# EAGLE design v0-cellphone (EAGLE 6.4)
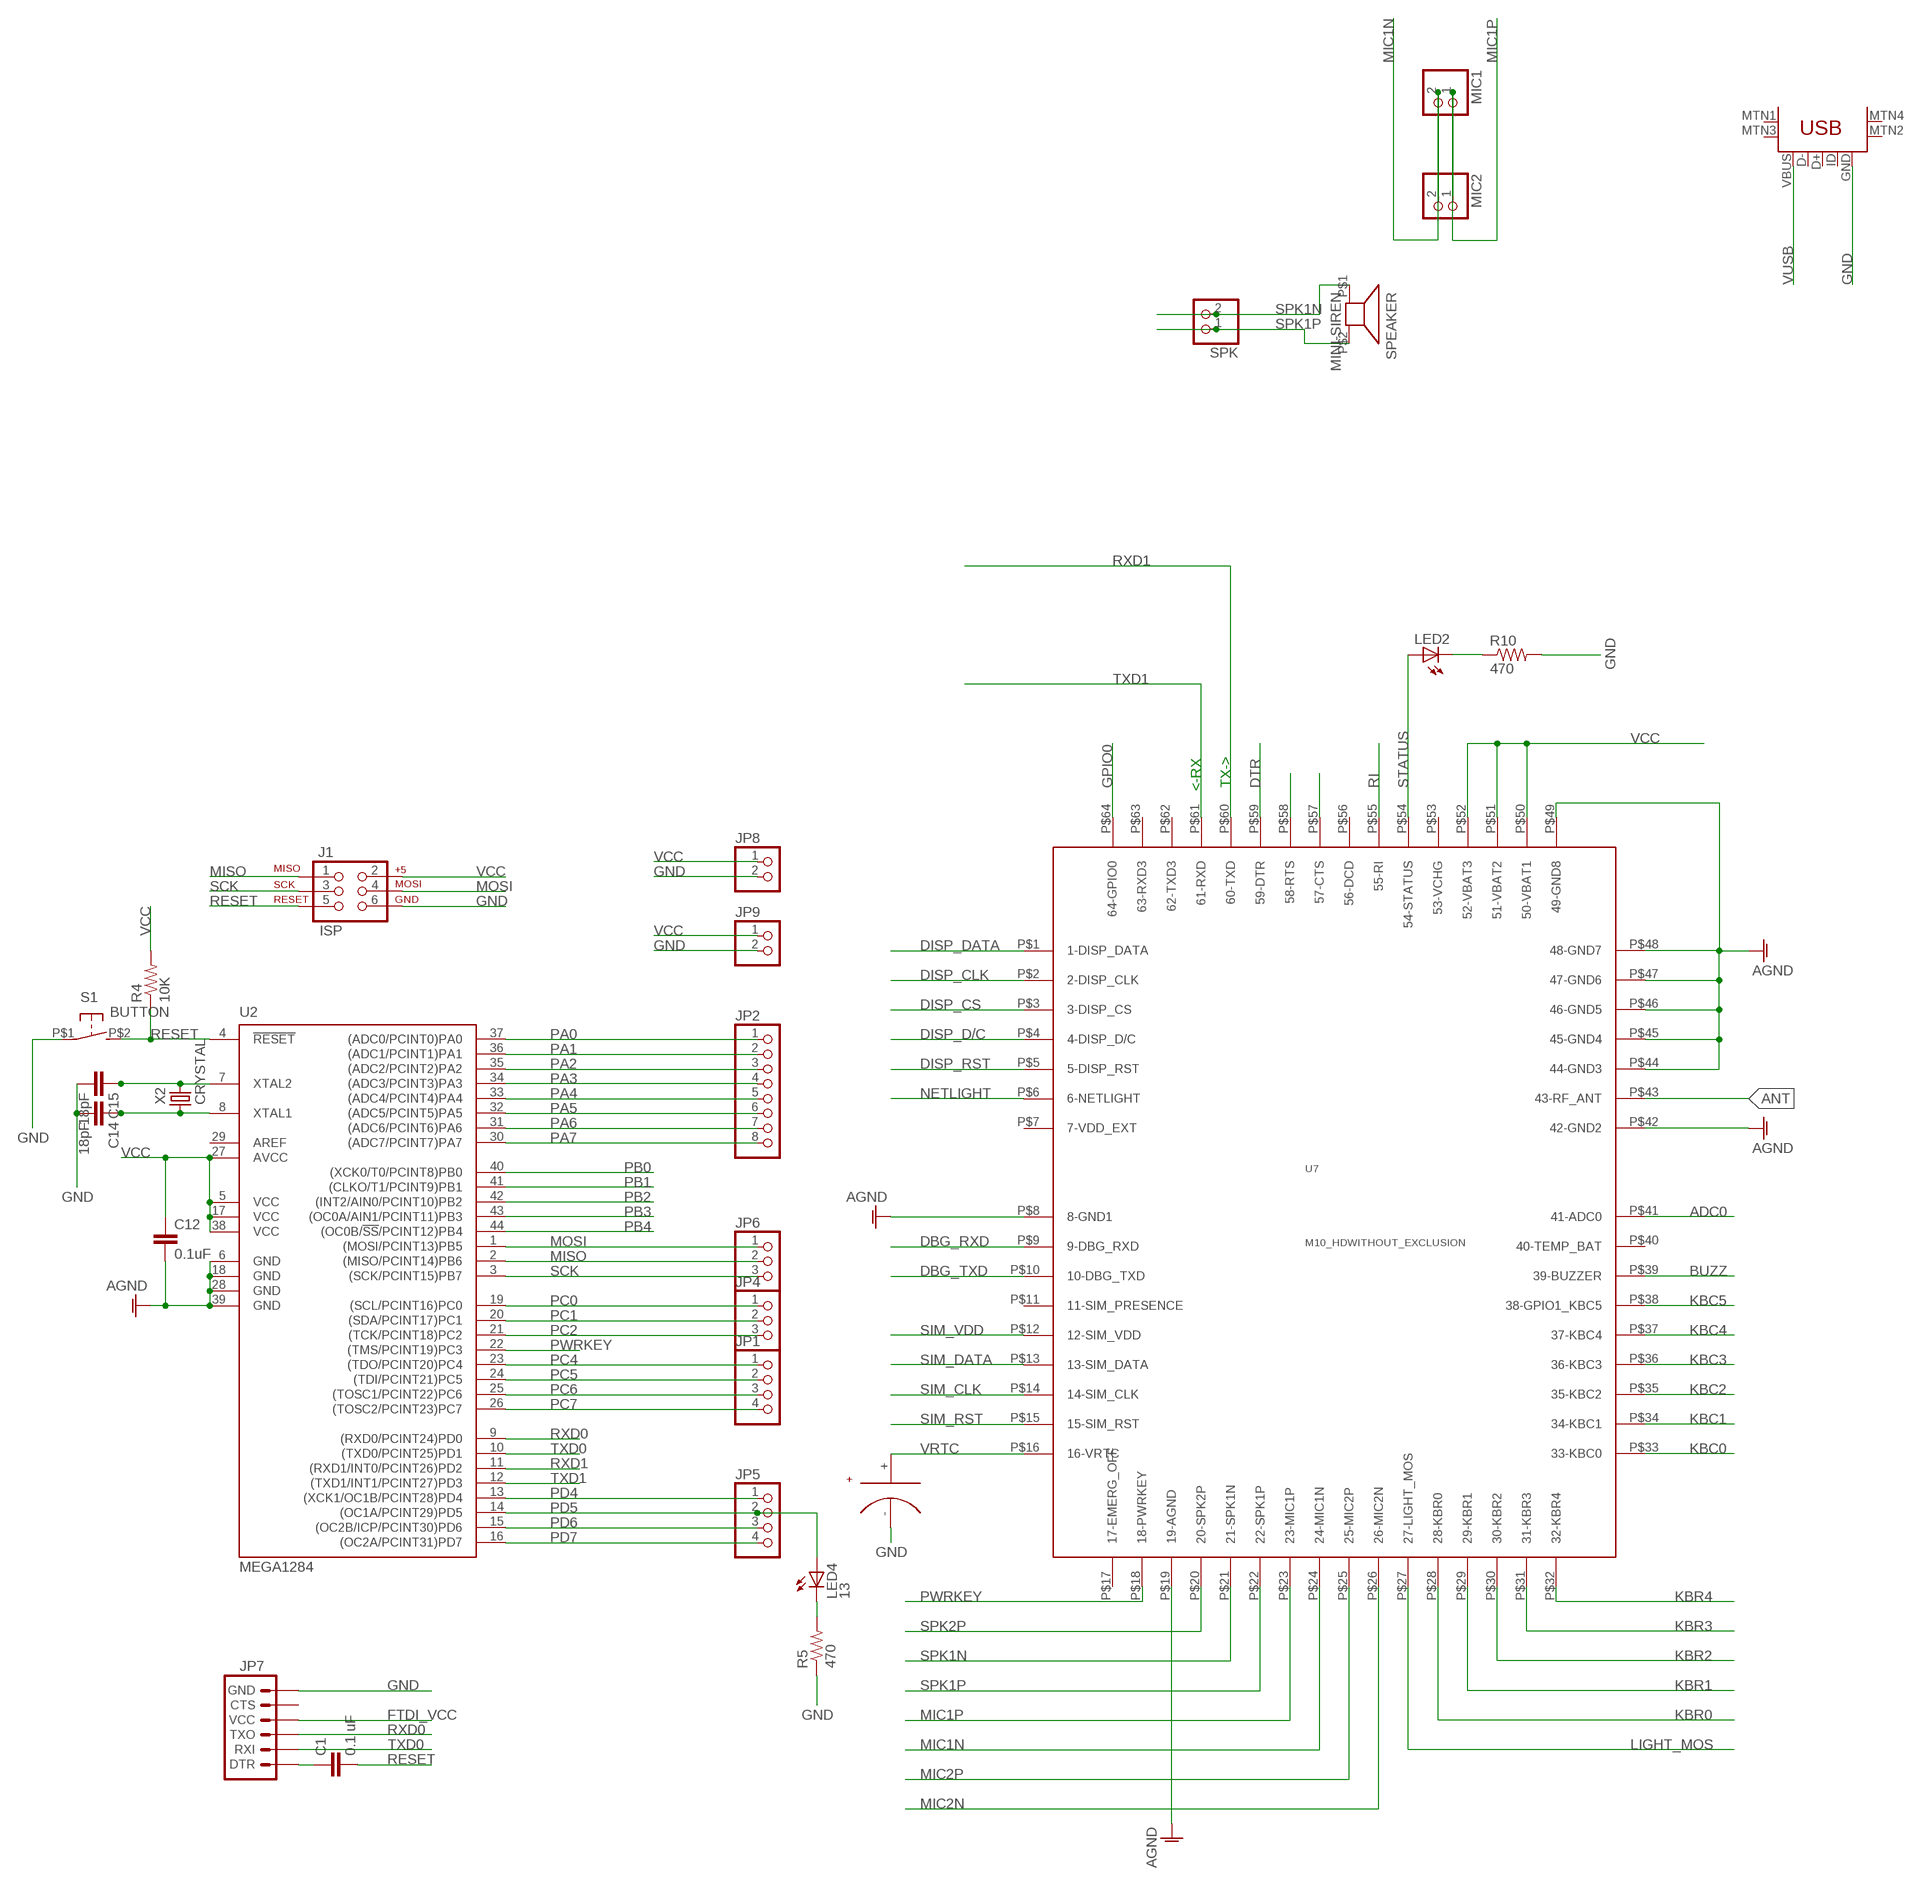
[diagram p0: schematic, sheet 1, part 1 of 2]
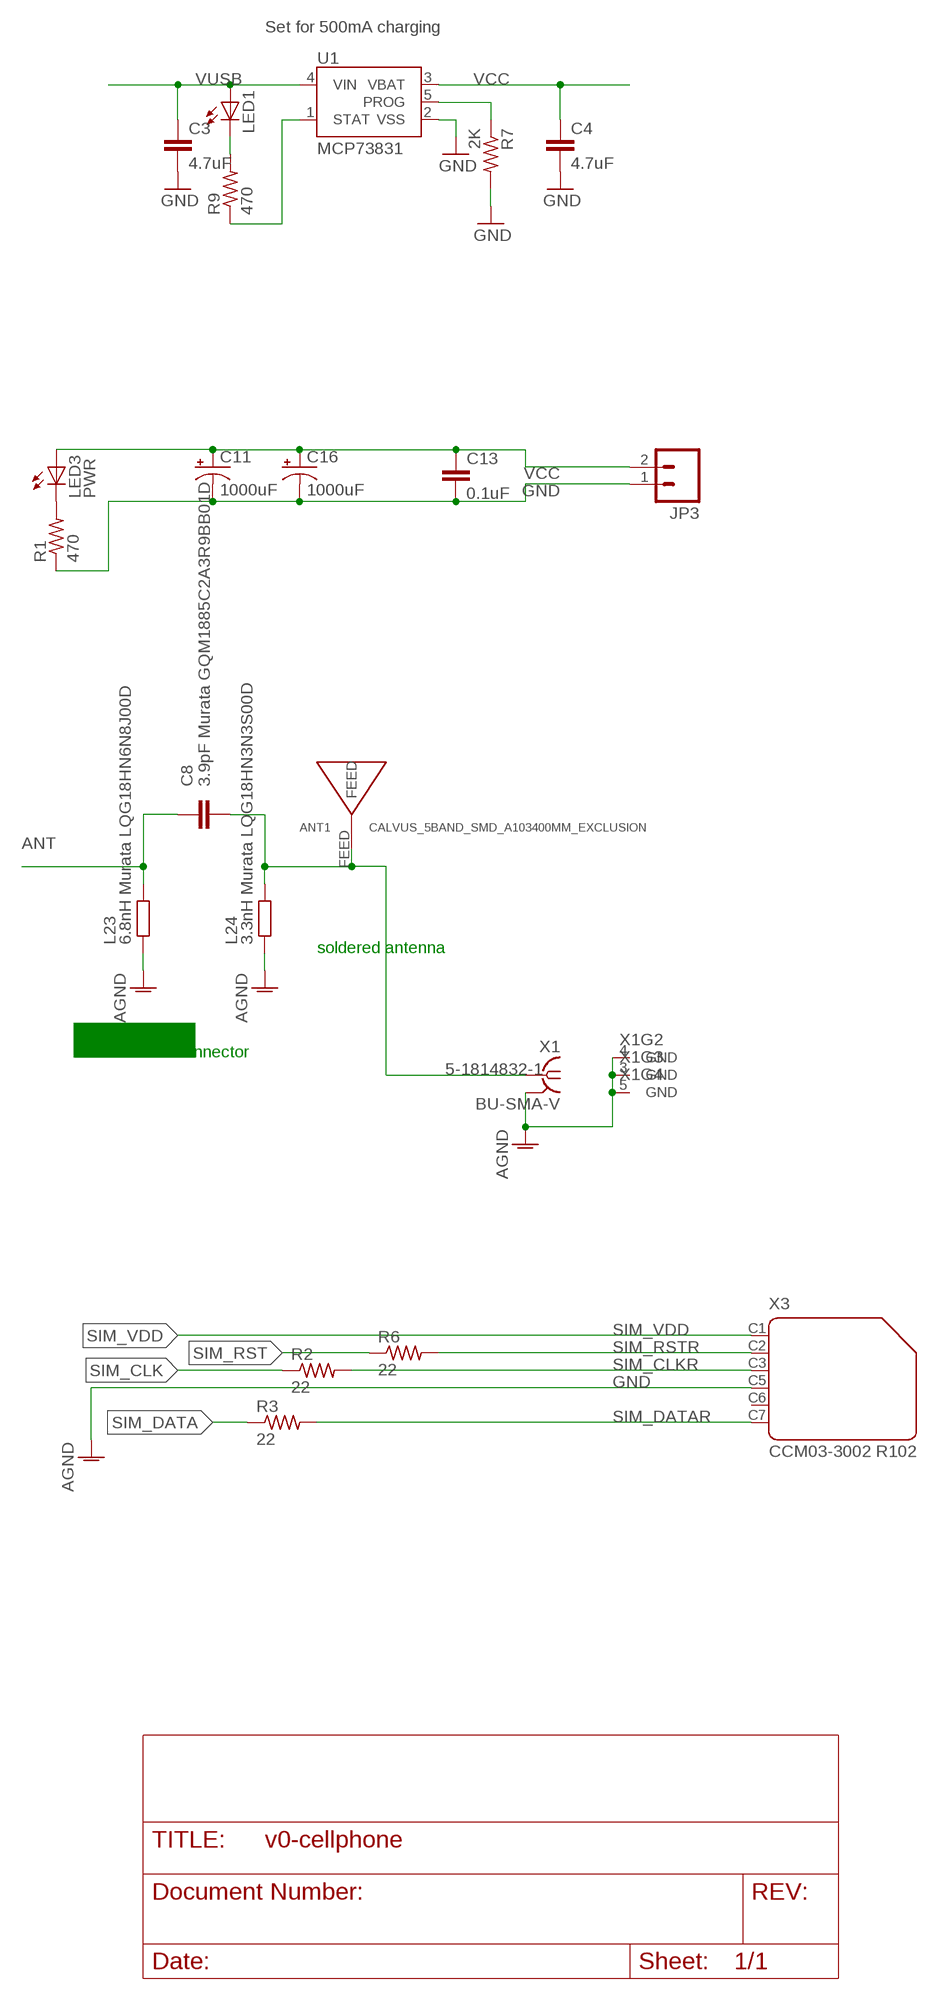
[diagram p1: schematic, sheet 1, part 2 of 2]

## Parts
ANT1  CALVUS_5BAND_SMD_A103400MM_EXCLUSION  [CALVUS_5BAND_SMD_A10340_0MM_EXCLUSION]
C1  0.1 uF  C-EUC1206  [C1206]
C2  SUPERCAPPAS  [414-VA5R]
C3  4.7uF  C-EUC1206  [C1206]
C4  4.7uF  C-EUC1206  [C1206]
C8  3.9pF Murata GQM1885C2A3R9BB01D  C-EU0603-RND  [C0603-ROUND]
C11  1000uF  CPOL-USD/7343-31R  [D/7343-31R]
C12  0.1uF  C-EUC1206  [C1206]
C13  0.1uF  C-EUC1206  [C1206]
C14  18pF  C-EUC1206  [C1206]
C15  18pF  C-EUC1206  [C1206]
C16  1000uF  CPOL-USD/7343-31R  [D/7343-31R]
J1  ISP  AVR_SPI_PRG_6NS  [2X3-NS]
J2  USB-MINIB-5PIN  [USB-MINIB]
JP1  PINHD-1X4  [1X04]
JP2  PINHD-1X8  [1X08]
JP3  M02-JST-2MM-SMT  [JST-2-SMD]
JP4  PINHD-1X3  [1X03]
JP5  PINHD-1X4  [1X04]
JP6  PINHD-1X3  [1X03]
JP7  ARDUINO_SERIAL_PROGRAMSMD-NOHOLES  [1X06-SMD-NOHOLES]
JP8  PINHD-1X2  [1X02]
JP9  PINHD-1X2  [1X02]
L23  6.8nH Murata LQG18HN6N8J00D  R-EU_0603-RND  [R0603-ROUND]
L24  3.3nH Murata LQG18HN3N3S00D  R-EU_0603-RND  [R0603-ROUND]
LED1  LEDSMT1206  [1206]
LED2  LEDSMT1206  [1206]
LED3  PWR  LEDSMT1206  [1206]
LED4  13  LEDSMT1206  [1206]
MIC1  PINHD-1X2  [1X02]
MIC2  PINHD-1X2  [1X02]
R1  470  R-US_R1206  [R1206]
R2  22  R-US_R1206  [R1206]
R3  22  R-US_R1206  [R1206]
R4  10K  R-US_R1206  [R1206]
R5  470  R-US_R1206  [R1206]
R6  22  R-US_R1206  [R1206]
R7  2K  R-US_R1206  [R1206]
R9  470  R-US_R1206  [R1206]
R10  470  R-US_R1206  [R1206]
S1  BUTTON  BUTTON-2  [B3U-1000P]
SPEAKER  MINI-SIREN  [SPEAKER-6.4MM]
SPK  PINHD-1X2  [1X02]
U1  MCP73831  [SOT23-5]
U2  MEGA1284  MEGA164P/324P/644P-AU  [TQFP44]
U7  M10_HDWITHOUT_EXCLUSION  [M10_HD_WITHOUT_EXCLUSION]
X1  BU-SMA-V  [BU-SMA-V]
X2  CRYSTAL  [2-SMD-5X3MM]
X3  CCM03-3002 R102  CON-AMPHENOL_SIMLOCK-C707_10M006_512_2  [CON-AMPHENOL_C707_10M006_512_2]

## Nets
ADC0: U7.P$41(41-ADC0)
ANT [antenna]: C8.1 L23.2 U7.P$43(43-RF_ANT)
ANTENA [antenna]: ANT1.FEED C8.2 L24.2 X1.1
BUZZ: U7.P$39(39-BUZZER)
DBG_RXD: U7.P$9(9-DBG_RXD)
DBG_TXD: U7.P$10(10-DBG_TXD)
DISP_CLK: U7.P$2(2-DISP_CLK)
DISP_CS: U7.P$3(3-DISP_CS)
DISP_D/C: U7.P$4(4-DISP_D/C)
DISP_DATA: U7.P$1(1-DISP_DATA)
DISP_RST: U7.P$5(5-DISP_RST)
DTR: U7.P$59(59-DTR)
FTDI_VCC: JP7.4(VCC)
GND [gnd]: C2.- C3.2 C4.2 C11.- C12.2 C13.2 C14.2 C15.2 C16.- J1.6 J2.GND JP3.1 JP7.6(GND) JP8.2 JP9.2 L23.1 L24.1 R1.1 R5.1 R7.2 R10.2 S1.P$1(P) U1.2(VSS) U2.6(GND) U2.18(GND) U2.28(GND) U2.39(GND) U7.P$8(8-GND1) U7.P$19(19-AGND) U7.P$42(42-GND2) U7.P$44(44-GND3) U7.P$45(45-GND4) U7.P$46(46-GND5) U7.P$47(47-GND6) U7.P$48(48-GND7) U7.P$49(49-GND8) X1.2(GND) X1.3(GND) X1.4(GND) X1.5(GND) X3.C5 ; supply symbol labelled AGND
GPIO0: U7.P$64(64-GPIO0)
KBC0: U7.P$33(33-KBC0)
KBC1: U7.P$34(34-KBC1)
KBC2: U7.P$35(35-KBC2)
KBC3: U7.P$36(36-KBC3)
KBC4: U7.P$37(37-KBC4)
KBC5: U7.P$38(38-GPIO1_KBC5)
KBR0: U7.P$28(28-KBR0)
KBR1: U7.P$29(29-KBR1)
KBR2: U7.P$30(30-KBR2)
KBR3: U7.P$31(31-KBR3)
KBR4: U7.P$32(32-KBR4)
LIGHT_MOS: U7.P$27(27-LIGHT_MOS)
MIC1N: MIC1.2 MIC2.2 U7.P$24(24-MIC1N)
MIC1P: MIC1.1 MIC2.1 U7.P$23(23-MIC1P)
MIC2N: U7.P$26(26-MIC2N)
MIC2P: U7.P$25(25-MIC2P)
MISO: J1.1 JP6.2 U2.2((MISO/PCINT14)PB6)
MOSI: J1.4 JP6.1 U2.1((MOSI/PCINT13)PB5)
N$1: U7.P$57(57-CTS)
N$2: LED3.C R1.2
N$3: LED4.C R5.2
N$5: C1.1 JP7.1(DTR)
N$7: C15.1 U2.7(XTAL2) X2.P$2
N$8: C14.1 U2.8(XTAL1) X2.P$1
N$35: R9.1 U1.1(STAT)
N$36: LED1.C R9.2
N$37: LED2.C R10.1
N$43: U7.P$58(58-RTS)
NETLIGHT: U7.P$6(6-NETLIGHT)
PA0: JP2.1 U2.37((ADC0/PCINT0)PA0)
PA1: JP2.2 U2.36((ADC1/PCINT1)PA1)
PA2: JP2.3 U2.35((ADC2/PCINT2)PA2)
PA3: JP2.4 U2.34((ADC3/PCINT3)PA3)
PA4: JP2.5 U2.33((ADC4/PCINT4)PA4)
PA5: JP2.6 U2.32((ADC5/PCINT5)PA5)
PA6: JP2.7 U2.31((ADC6/PCINT6)PA6)
PA7: JP2.8 U2.30((ADC7/PCINT7)PA7)
PB0: U2.40((XCK0/T0/PCINT8)PB0)
PB1: U2.41((CLKO/T1/PCINT9)PB1)
PB2: U2.42((INT2/AIN0/PCINT10)PB2)
PB3: U2.43((OC0A/AIN1/PCINT11)PB3)
PB4: U2.44((OC0B/!SS!/PCINT12)PB4)
PC0: JP4.1 U2.19((SCL/PCINT16)PC0)
PC1: JP4.2 U2.20((SDA/PCINT17)PC1)
PC2: JP4.3 U2.21((TCK/PCINT18)PC2)
PC4: JP1.1 U2.23((TDO/PCINT20)PC4)
PC5: JP1.2 U2.24((TDI/PCINT21)PC5)
PC6: JP1.3 U2.25((TOSC1/PCINT22)PC6)
PC7: JP1.4 U2.26((TOSC2/PCINT23)PC7)
PD4: JP5.1 U2.13((XCK1/OC1B/PCINT28)PD4)
PD5: JP5.2 LED4.A U2.14((OC1A/PCINT29)PD5)
PD6: JP5.3 U2.15((OC2B/ICP/PCINT30)PD6)
PD7: JP5.4 U2.16((OC2A/PCINT31)PD7)
PROG: R7.1 U1.5(PROG)
PWRKEY: U2.22((TMS/PCINT19)PC3) U7.P$18(18-PWRKEY)
RESET: C1.2 J1.5 R4.1 S1.P$2(S) U2.4(!RESET)
RI: U7.P$55(55-RI)
RXD0: JP7.3(TXO) U2.9((RXD0/PCINT24)PD0)
RXD1: U2.11((RXD1/INT0/PCINT26)PD2) U7.P$60(60-TXD)
SCK: J1.3 JP6.3 U2.3((SCK/PCINT15)PB7)
SIM_CLK: R2.1 U7.P$14(14-SIM_CLK)
SIM_CLKR: R2.2 X3.C3
SIM_DATA: R3.1 U7.P$13(13-SIM_DATA)
SIM_DATAR: R3.2 X3.C7
SIM_RST: R6.1 U7.P$15(15-SIM_RST)
SIM_RSTR: R6.2 X3.C2
SIM_VDD: U7.P$12(12-SIM_VDD) X3.C1
SPK1N: SPEAKER.P$1 SPK.2 U7.P$21(21-SPK1N)
SPK1P: SPEAKER.P$2 SPK.1 U7.P$22(22-SPK1P)
SPK2P: U7.P$20(20-SPK2P)
STATUS: LED2.A U7.P$54(54-STATUS)
TXD0: JP7.2(RXI) U2.10((TXD0/PCINT25)PD1)
TXD1: U2.12((TXD1/INT1/PCINT27)PD3) U7.P$61(61-RXD)
VCC [power]: C4.1 C11.+ C12.1 C13.1 C16.+ J1.2 JP3.2 JP8.1 JP9.1 LED3.A R4.2 U1.3(VBAT) U2.5(VCC) U2.17(VCC) U2.27(AVCC) U2.38(VCC) U7.P$50(50-VBAT1) U7.P$51(51-VBAT2) U7.P$52(52-VBAT3)
VRTC: C2.+ U7.P$16(16-VRTC)
VUSB: C3.1 J2.VBUS LED1.A U1.4(VIN)
Unconnected: J2.D+ J2.D- J2.ID J2.MTN1(MTN2) J2.MTN2(MTN3) J2.MTN3(MTN1) J2.MTN4 JP7.5(CTS) U7.P$7(7-VDD_EXT) U7.P$11(11-SIM_PRESENCE) U7.P$17(17-EMERG_OFF) U7.P$40(40-TEMP_BAT) U7.P$53(53-VCHG) U7.P$56(56-DCD) U7.P$62(62-TXD3) U7.P$63(63-RXD3) X3.C6

## Notes on the sheet
- Set for 500mA charging
- <-RX
- TX->
- soldered antenna
- SMA or U.FL connector

## Power pins joined to a net without a drawn wire
AREF: U2.29(AREF)

## Library data of the parts
ANT1 = SmartPrj:CALVUS_5BAND_SMD_A10340
C1 C3 C4 C12-C15 = cellphone-rcl:C-EU: CAPACITOR, European symbol
C2 = cellphone:SUPERCAP
C8 = SmartPrj:C-EU: CAPACITOR, European symbol
C11 C16 = cellphone-rcl:CPOL-US: POLARIZED CAPACITOR, American symbol
J1 = SparkFun-Connectors:AVR_SPI_PRG_6: AVR ISP 6 Pin This is the reduced ISP connector for AVR programming. Common on Arduino. This footprint will take up less PCB space and can be used with a 10-pin to 6-pin adapter such as SKU: BOB-08508
J2 = SparkFun-Connectors:USB-MINIB: Mini-USB "B" connector with 5th pin broken out. Created new symbol breaking out 5th "ID" pin in mini/micro USB connector spec. See: http://en.wikipedia.org/wiki/Mini_usb#Cables. Uses same footprint as 4-pin symbol. Also added pins to connect to mounting / shield pads if required (probably not generally needed as signals aren't shielded once they leave the connector).
JP1 JP5 = pinhead:PINHD-1X4: PIN HEADER
JP2 = pinhead:PINHD-1X8: PIN HEADER
JP3 = SparkFun-Connectors:M02: Header 2 Standard 2-pin 0.1" header. Use with straight break away headers (SKU : PRT-00116), right angle break away headers (PRT-00553), swiss pins (PRT-00743), machine pins (PRT-00117), and female headers (PRT-00115). Molex polarized connector foot print use with SKU : PRT-08233 with associated crimp pins and housings.
JP4 JP6 = pinhead:PINHD-1X3: PIN HEADER
JP7 = cellphone:ARDUINO_SERIAL_PROGRAM: FTDI connector footprints
JP8 JP9 MIC1 MIC2 SPK = pinhead:PINHD-1X2: PIN HEADER
L23 L24 = SmartPrj:R-EU_: RESISTOR, European symbol
LED1-LED4 = cellphone-led:LED: LED OSRAM: - CHIPLED LG R971, LG N971, LY N971, LG Q971, LY Q971, LO R971, LY R971 LH N974, LH R974 LS Q976, LO Q976, LY Q976 LO Q996 - Hyper CHIPLED LW Q18S LB Q993, LB Q99A, LB R99A - SideLED LS A670, LO A670, LY A670, LG A670, LP A670 LB A673, LV A673, LT A673, LW A673 LH A674 LY A675 LS A676, LA A676, LO A676, LY A676, LW A676 LS A679, LY A679, LG A679 - Hyper Micro SIDELED® LS Y876, LA Y876, LO Y876, LY Y876 LT Y87S - SmartLED LW L88C, LW L88S LB L89C, LB L89S, LG L890 LS L89K, LO L89K, LY L89K LS L896, LA L896, LO L896, LY L896 - TOPLED LS T670, LO T670, LY T670, LG T670, LP T670 LSG T670, LSP T670, LSY T670, LOP T670, LYG T670 LG T671, LOG T671, LSG T671 LB T673, LV T673, LT T673, LW T673 LH T674 LS T676, LA T676, LO T676, LY T676, LB T676, LH T676, LSB T676, LW T676 LB T67C, LV T67C, LT T67C, LS T67K, LO T67K, LY T67K, LW E67C LS E67B, LA E67B, LO E67B, LY E67B, LB E67C, LV E67C, LT E67C LW T67C LS T679, LY T679, LG T679 LS T770, LO T770, LY T770, LG T770, LP T770 LB T773, LV T773, LT T773, LW T773 LH T774 LS E675, LA E675, LY E675, LS T675 LS T776, LA T776, LO T776, LY T776, LB T776 LHGB T686 LT T68C, LB T68C - Hyper Mini TOPLED® LB M676 - Mini TOPLED Santana® LG M470 LS M47K, LO M47K, LY M47K Source: http://www.osram.convergy.de LUXEON: - LUMILED® LXK2-PW12-R00, LXK2-PW12-S00, LXK2-PW14-U00, LXK2-PW14-V00 LXK2-PM12-R00, LXK2-PM12-S00, LXK2-PM14-U00 LXK2-PE12-Q00, LXK2-PE12-R00, LXK2-PE12-S00, LXK2-PE14-T00, LXK2-PE14-U00 LXK2-PB12-K00, LXK2-PB12-L00, LXK2-PB12-M00, LXK2-PB14-N00, LXK2-PB14-P00, LXK2-PB14-Q00 LXK2-PR12-L00, LXK2-PR12-M00, LXK2-PR14-Q00, LXK2-PR14-R00 LXK2-PD12-Q00, LXK2-PD12-R00, LXK2-PD12-S00 LXK2-PH12-R00, LXK2-PH12-S00 LXK2-PL12-P00, LXK2-PL12-Q00, LXK2-PL12-R00 Source: www.luxeon.com KINGBRIGHT: KA-3528ASYC Source: www.kingbright.com
R1-R7 R9 R10 = cellphone-rcl:R-US_: RESISTOR, American symbol
S1 = cellphone:BUTTON-2
SPEAKER = cellphone:MINI-SIREN
U1 = SparkFun:MCP73831: Microchip's MCP73831 Miniature single cell, fully integrated Li-Ion, Li-polymer charge management controller http://ww1.microchip.com/downloads/en/DeviceDoc/21984a.pdf
U2 = avr-5:MEGA164P/324P/644P-AU
U7 = GSM:M10_HD
X1 = con-coax:BU-SMA-V: FEMALE SMA CONNECTOR Radiall distributor RS 112-3794; PN: 5-1814832-1
X2 = fab:CRYSTAL
X3 = SmartPrj:CON-AMPHENOL_SIMLOCK-C707_10M006_512_2: C707A SIMLOCK® 2.5 mm with wide solder tails Source: Data sheet <http://www.amphenol.info/downloads/C707_10M006_512_2.pdf>; OC_FARNELL: 1463072; OC_NEWARK: unknown

## Net classes
1 power: width 0.254 mm, drill 0.406 mm, clearance 0.178 mm
2 gnd: width 0.254 mm, drill 0.406 mm, clearance 0.178 mm
3 power usb: width 0.254 mm, drill 0.406 mm, clearance 0.178 mm
4 antenna: clearance 0.61 mm

## Board
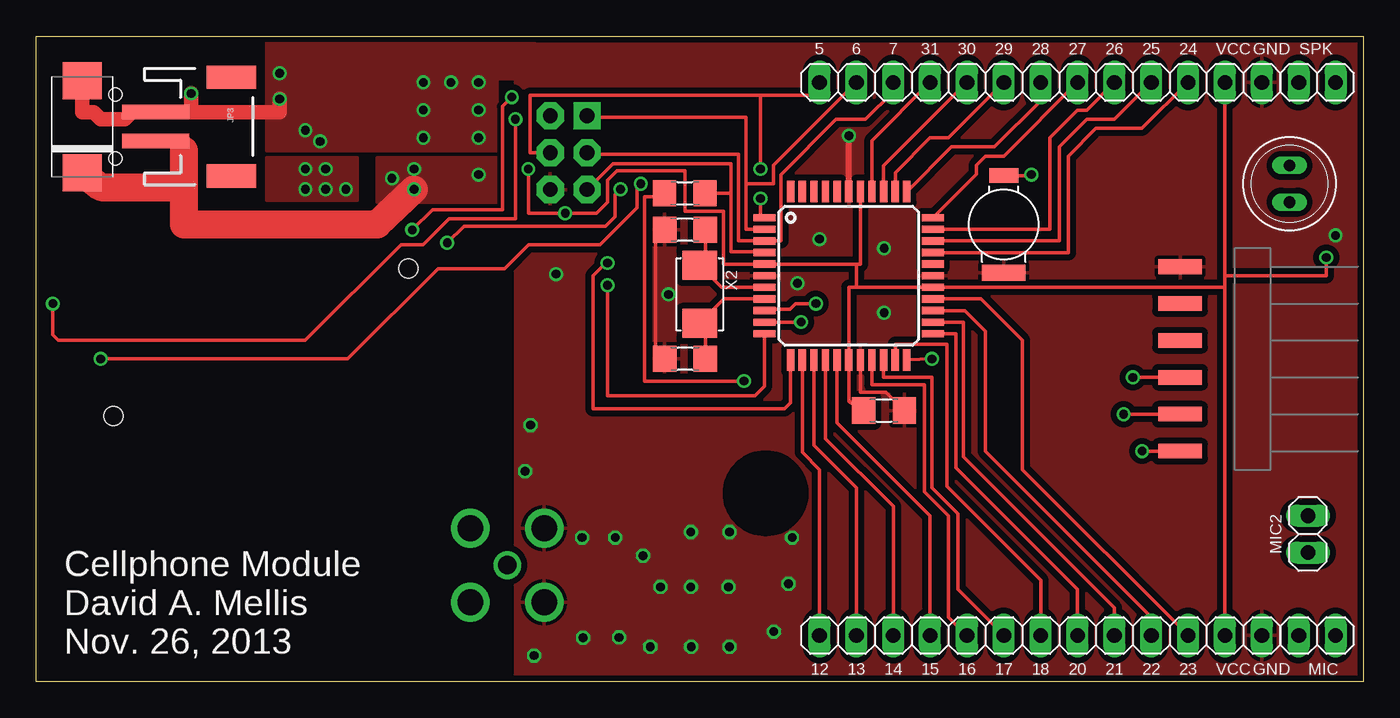
[diagram p2: board, top side]
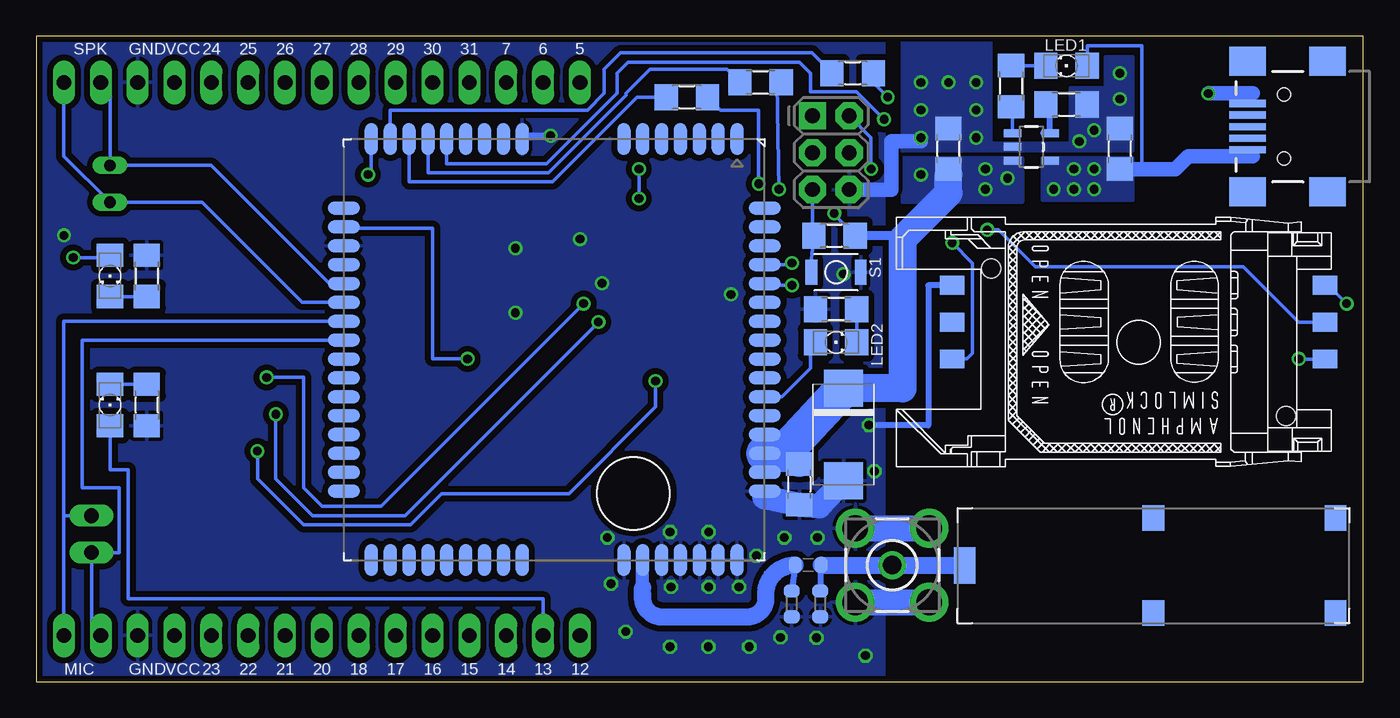
[diagram p3: board, bottom side, seen from below]

Size 91.44 x 44.45 mm. Coordinates in mm from the lower left corner, seen from the top.
Outline: 0,44.45 91.44,44.45 91.44,0 0,0 0,44.45
Copper layers (1*16): Top 0.0356mm / dielectric 1.5011mm / Bottom 0.0356mm
Design rules "LaenPCBOrder": minimum track width 6mil, minimum drill 13mil, track to track 6mil, track to pad 6mil, pad to pad 6mil, via to via 6mil, smd to smd 6mil, copper to edge 15mil, drill to drill 6mil, minimum pad ring 7mil, minimum via ring 7mil, stop-mask expansion 3mil, vias tented up to drill 0mil, thermal gap 10mil

### Footprints (pad centres in the part's own frame; a part is rotated, then mirrored left to right if it is on the bottom)
CALVUS_5BAND_SMD_A10340_0MM_EXCLUSION = smd 2.5 x 1.5: FEED 3.95,0.5 | smd 1.75 x 1.5: FIXINGPOINT$1 0.7,26.05; FIXINGPOINT$2 7.22,26.05; FIXINGPOINT$3 0.7,13.49; FIXINGPOINT$4 7.22,13.49
C1206 = smd 1.6 x 1.8: 1 -1.4,0; 2 1.4,0
414-VA5R = smd 1 x 2: + -3.35,0 | smd 1.1 x 3: - 3.35,0
C0603-ROUND = smd 0.898 x 1.1: 1 -0.889,0; 2 0.889,0
D/7343-31R = smd 2.55 x 2.7: + 3.175,0; - -3.175,0
2X3-NS = drill 1.016 pad 1.88 square: 1 -2.54,-1.27 | drill 1.016 pad 1.88 octagon: 2 -2.54,1.27; 3 0,-1.27; 4 0,1.27; 5 2.54,-1.27; 6 2.54,1.27
USB-MINIB = smd 2.5 x 0.5: D+ 2.5,0; D- 2.5,0.8; GND 2.5,-1.6; ID 2.5,-0.8; VBUS 2.5,1.6 | smd 2.5 x 2: MTN1 -3,4.5; MTN2 2.5,4.5; MTN3 -3,-4.5; MTN4 2.5,-4.5 | hole 0.9: 0,2.2; 0,-2.2
1X04 = drill 1.016 long: 1 -3.81,0; 2 -1.27,0; 3 1.27,0; 4 3.81,0
1X08 = drill 1.016 long: 1 -8.89,0; 2 -6.35,0; 3 -3.81,0; 4 -1.27,0; 5 1.27,0; 6 3.81,0; 7 6.35,0; 8 8.89,0
JST-2-SMD = smd 1 x 4.6: 1 -1,-3.7; 2 1,-3.7 | smd 1.6 x 3.4: NC1 -3.4,1.5; NC2 3.4,1.5
1X03 = drill 1.016 long: 1 -2.54,0; 2 0,0; 3 2.54,0
1X06-SMD-NOHOLES = smd 1 x 3: 1 -6.35,5; 2 -3.81,5; 3 -1.27,5; 4 1.27,5; 5 3.81,5; 6 6.35,5
1X02 = drill 1.016 long: 1 -1.27,0; 2 1.27,0
R0603-ROUND = smd 0.898 x 1.1: 1 -0.889,0; 2 0.889,0
1206 = smd 1.6 x 1.803: A -1.422,0; C 1.422,0
R1206 = smd 1.6 x 1.803: 1 -1.422,0; 2 1.422,0
B3U-1000P = smd 0.8 x 1.7: P$1 -1.7,0; P$2 1.7,0
SPEAKER-6.4MM = drill 0.8 long: P$1 -1.27,0; P$2 1.27,0
SOT23-5 = smd 0.55 x 1.2: 1 -0.95,-1.3; 2 0,-1.3; 3 0.95,-1.3; 4 0.95,1.3; 5 -0.95,1.3
TQFP44 = smd 1.5 x 0.5: 1 -5.8,4; 2 -5.8,3.2; 3 -5.8,2.4; 4 -5.8,1.6; 5 -5.8,0.8; 6 -5.8,0; 7 -5.8,-0.8; 8 -5.8,-1.6; 9 -5.8,-2.4; 10 -5.8,-3.2; 11 -5.8,-4; 23 5.8,-4; 24 5.8,-3.2; 25 5.8,-2.4; 26 5.8,-1.6; 27 5.8,-0.8; 28 5.8,0; 29 5.8,0.8; 30 5.8,1.6; 31 5.8,2.4; 32 5.8,3.2; 33 5.8,4 | smd 0.5 x 1.5: 12 -4,-5.8; 13 -3.2,-5.8; 14 -2.4,-5.8; 15 -1.6,-5.8; 16 -0.8,-5.8; 17 0,-5.8; 18 0.8,-5.8; 19 1.6,-5.8; 20 2.4,-5.8; 21 3.2,-5.8; 22 4,-5.8; 34 4,5.8; 35 3.2,5.8; 36 2.4,5.8; 37 1.6,5.8; 38 0.8,5.8; 39 0,5.8; 40 -0.8,5.8; 41 -1.6,5.8; 42 -2.4,5.8; 43 -3.2,5.8; 44 -4,5.8
M10_HD_WITHOUT_EXCLUSION = smd 2.2 x 0.9: P$1 0,27.1; P$2 0,25.8; P$3 0,24.5; P$4 0,23.2; P$5 0,21.9; P$6 0,20.6; P$7 0,19.3; P$8 0,12.3; P$9 0,11; P$10 0,9.7; P$11 0,8.4; P$12 0,7.1; P$13 0,5.8; P$14 0,4.5; P$15 0,3.2; P$16 0,1.9; P$33 29,1.9; P$34 29,3.2; P$35 29,4.5; P$36 29,5.8; P$37 29,7.1; P$38 29,8.4; P$39 29,9.7; P$40 29,11; P$41 29,12.3; P$42 29,19.3; P$43 29,20.6; P$44 29,21.9; P$45 29,23.2; P$46 29,24.5; P$47 29,25.8; P$48 29,27.1 | smd 0.9 x 2.2: P$17 4.75,0; P$18 6.05,0; P$19 7.35,0; P$20 8.65,0; P$21 9.95,0; P$22 11.25,0; P$23 12.55,0; P$24 13.85,0; P$25 15.15,0; P$26 16.45,0; P$27 17.75,0; P$28 19.05,0; P$29 20.35,0; P$30 21.65,0; P$31 22.95,0; P$32 24.25,0; P$49 24.25,29; P$50 22.95,29; P$51 21.65,29; P$52 20.35,29; P$53 19.05,29; P$54 17.75,29; P$55 16.45,29; P$56 15.15,29; P$57 13.85,29; P$58 12.55,29; P$59 11.25,29; P$60 9.95,29; P$61 8.65,29; P$62 7.35,29; P$63 6.05,29; P$64 4.75,29
BU-SMA-V = drill 1.27: 1 0,0 | drill 1.778: 2 -2.55,2.55; 3 2.55,2.55; 4 2.55,-2.55; 5 -2.55,-2.55
2-SMD-5X3MM = smd 2 x 2.4: P$1 -2,0; P$2 2,0
CON-AMPHENOL_C707_10M006_512_2 = smd 1.7 x 1.3: C1 -12.85,-3.915; C2 -12.85,-1.375; C3 -12.85,1.165; C5 12.85,-3.915; C6 12.85,-1.375; C7 12.85,1.165 | hole 1.3: 10.16,-5.08; -10.16,5.08

### Placement (x,y rotation side)
ANT1  27.96,11.95 270 bottom
C1  44.69,33.64 0 top
C2  66.67,31.5 270 top
C3  16.76,36.7 90 bottom
C4  28.57,36.7 90 bottom
C8  38.25,8.02 0 bottom
C11  3.17,38.23 270 top
C12  58.42,18.67 0 top
C13  38.86,13.59 270 bottom
C14  44.7,22.23 180 top
C15  44.7,31.11 180 top
C16  35.81,17.02 90 bottom
J1  36.68,36.43 270 bottom
J2  5.46,38.23 180 bottom
JP1  75.56,3.17 0 top
JP2  70.48,41.27 0 top
JP3  11.94,38.23 270 top
JP4  66.67,3.17 0 top
JP5  57.78,3.17 0 top
JP6  56.52,41.27 0 top
JP7  83.82,22.23 90 top
JP8  83.19,3.17 0 top
JP9  83.19,41.27 0 top
L23  39.39,5.35 90 bottom
L24  37.41,5.35 90 bottom
LED1  20.45,42.42 180 bottom
LED2  36.32,23.37 0 bottom
LED3  86.36,27.94 270 bottom
LED4  86.36,19.05 90 bottom
MIC1  88.27,3.17 180 top
MIC2  87.63,10.16 270 top
R1  83.82,27.94 270 bottom
R2  46.61,40.26 0 bottom
R3  41.53,41.27 0 bottom
R4  36.43,30.71 0 bottom
R5  83.82,19.05 90 bottom
R6  35.18,41.91 0 bottom
R7  20.45,39.75 0 bottom
R9  24.26,41.02 90 bottom
R10  36.32,25.65 180 bottom
S1  36.32,28.19 180 bottom
SPEAKER  86.36,34.29 270 top
SPK  88.27,41.27 180 top
U1  22.86,36.83 270 bottom
U2  55.99,27.96 0 top
U7  70.25,37.37 270 bottom
X1  32.45,8.02 0 bottom
X2  45.72,26.67 90 top
X3  15.47,23.38 180 bottom

### Tracks (layer width: path | path; a pad name or v marks a point on that pad's centre or on a via)
ANT
  Bottom 0.406: C8.1 L23.2
  Bottom 0.889: 49.65,6.49 U7.P$43
  Bottom 1.168: 49.65,6.49 49.65,5.99 arc-90 48.51,4.46 42.31,4.46 arc-90 41.17,5.86 41.17,6.11 arc90 C8.1
ANTENA
  Bottom 0.406: 37.1,7.8 C8.2 37.36,6.24 L24.2
  Bottom 1.168: ANT1.FEED arc-90 27.86,8.02 X1.1 C8.2
GND  (via drill 0.6, 0.61)
  Top 0.254: U2.18 56.79,19.94 58.55,19.94 C12.2 | C15.2 42.67,31.11 42.67,22.23 C14.2
  Top 0.406: U2.39 56.01,33.76 v56.01,37.59
  Top 1.016: C11.- 3.17,39.23 3.95,39.23 4.45,38.73 6.1,38.73 6.6,39.24 JP3.1 10.67,39.23 | 10.67,39.23 16.76,39.23 v16.76,40.13 | 10.67,39.23 v10.67,40.51
  Bottom 0.406: 41.27,12.7 U7.P$49 | J2.GND 8.89,39.83 8.89,40.51 | v56.01,37.59 57.95,37.59 U7.P$8 | X3.C5 29.97,27.3 29.97,17.65 34.05,17.65 v34.05,17.67
  Bottom 1.016: v10.67,40.51 8.89,40.51 7.62,40.51 | J1.6 32.51,33.89 32.51,37.21 30.48,37.21 v30.48,37.47
  Bottom 1.676: C16.- 37.47,12.06 C13.2 41.27,12.7
  Bottom 1.778: X1.5 X1.4 | X1.2 X1.3
  other vias: 47.69,6.52 45.1,6.52 41.8,8.68 43.02,6.52 47.77,2.4 45.13,2.4 42.31,2.4 40.15,3.04 51.84,6.75 50.82,3.44 39.9,9.92 34.31,1.79 37.69,3.01 33.67,14.49 52.09,9.92 47.77,10.3 45.1,10.3 37.61,9.92 16.76,41.91 26.67,39.37 26.67,37.47 30.48,39.37 30.48,41.27 28.57,41.27 26.67,41.27 18.54,37.97 19.56,37.21 53.98,30.48 58.42,29.84 58.42,25.4 52.45,27.43 35.81,28.07 43.56,26.67 89.53,30.73
  pour Bottom (isolate 0.254, no thermals): 20.19,37.08 25.65,37.08 25.65,44.32 31.75,44.32 31.75,36.58 15.88,36.58 15.88,43.05 17.78,43.05 17.78,40.89 20.19,40.89
  pour Top (isolate 0.254, no thermals): 15.88,36.58 31.75,36.58 31.75,41.53 34.29,41.53 34.29,44.32 15.88,44.32
  pour Bottom (isolate 0.406): 91.31,44.32 33.02,44.32 33.02,0.13 91.31,0.13
  pour Top (isolate 0.406): 91.31,44.32 33.02,44.32 33.02,0.13 91.31,0.13
MIC1N
  Bottom 0.254: U7.P$24 88.27,23.52 88.27,13.34 85.72,13.34 85.72,8.89 MIC2.2 87.63,3.17 MIC1.2
MIC1P
  Bottom 0.254: U7.P$23 89.53,24.82 89.53,11.43 | MIC2.1 89.53,11.43 | 89.53,11.43 MIC1.1
MISO
  Top 0.254: U2.2 48.9,31.16 48.9,34.29 | 48.9,34.29 48.9,38.86 37.95,38.86 J1.1 | JP6.2 50.8,35.56 50.8,34.29 48.9,34.29
MOSI  (via drill 0.6)
  Top 0.254: J1.4 34.04,36.43 34.04,40.39 49.91,40.39 | 49.91,40.39 53.98,40.39 JP6.1 | U2.1 49.91,31.98 v49.91,33.27 | v49.91,35.31 49.91,40.39
  Bottom 0.254: v49.91,33.27 v49.91,35.31
N$2
  Bottom 0.254: LED3.C R1.2
N$3
  Bottom 0.254: LED4.C R5.2
N$5  (via drill 0.6)
  Top 0.254: v48.77,20.7 41.91,20.7 41.91,33.4 43.16,33.4 C1.1 | JP7.1 v76.2,15.88
  Bottom 0.254: v48.77,20.7 48.77,18.92 54.74,12.95 63.5,12.95 65.66,10.79 73.03,10.79 76.2,13.97 v76.2,15.88
N$7
  Top 0.254: C15.1 46.1,28.67 X2.P$2 47.23,27.16 U2.7
N$8
  Top 0.254: C14.1 46.1,24.67 X2.P$1 47.41,26.36 U2.8
N$35
  Bottom 0.254: R9.1 24.16,39.6 U1.1
N$36
  Bottom 0.254: LED1.C 24.26,42.42 R9.2
N$37
  Bottom 0.254: LED2.C R10.1
PA0
  Top 0.254: U2.37 57.59,37.27 JP2.1
PA1
  Top 0.254: U2.36 58.39,35.53 JP2.2
PA2
  Top 0.254: U2.35 59.19,35.06 61.59,37.47 62.87,37.47 JP2.3
PA3
  Top 0.254: U2.34 63.06,36.83 66.04,36.83 69.22,40.01 JP2.4
PA4
  Top 0.254: U2.33 64.77,34.94 64.77,35.56 65.41,36.2 66.67,36.2 JP2.5
PA5
  Top 0.254: U2.32 69.85,31.16 69.85,37.47 71.75,39.37 72.39,39.37 JP2.6
PA6
  Top 0.254: U2.31 70.48,30.36 70.48,36.83 72.39,38.73 74.3,38.73 JP2.7
PA7
  Top 0.254: U2.30 71.12,29.56 71.12,36.2 73.03,38.1 76.2,38.1 JP2.8
PC0
  Top 0.254: U2.19 57.59,20.45 61.21,20.45 61.21,13.08 62.87,11.43 62.87,4.45 JP4.1
PC1
  Top 0.254: U2.20 58.39,20.95 61.72,20.95 61.72,13.34 63.5,11.56 63.5,6.35 JP4.2
PC2
  Top 0.254: U2.21 59.19,23.24 62.74,23.24 62.74,13.46 69.22,6.99 JP4.3
PC4
  Top 0.254: U2.23 63.37,23.96 63.37,14.73 69.34,8.76 69.85,8.26 71.75,6.35 JP1.1
PC5
  Top 0.254: U2.24 63.88,24.76 63.88,15.49 74.3,5.08 JP1.2
PC6
  Top 0.254: U2.25 63.98,25.56 65.41,24.13 65.41,15.88 76.83,4.45 JP1.3
PC7
  Top 0.254: U2.26 65.08,26.36 67.94,23.5 67.94,14.61 JP1.4
PD4
  Top 0.254: U2.13 52.79,15.79 53.98,14.61 JP5.1
PD5
  Top 0.254: U2.14 53.59,16.26 56.52,13.34 JP5.2
  Bottom 0.254: JP5.2 56.52,5.71 85.09,5.71 85.09,14.61 86.36,14.61 LED4.A
PD6
  Top 0.254: U2.15 54.39,16.73 59.05,12.06 JP5.3
PD7
  Top 0.254: U2.16 55.19,17.84 61.59,11.43 JP5.4
PROG
  Bottom 0.406: U1.5 21.59,37.78 | 22.07,37.78 21.59,37.78 | 21.59,37.78 21.59,40.01 R7.1
PWRKEY  (via drill 0.6)
  Top 0.254: U2.22 60.07,22.16 v61.72,22.23
  Bottom 0.254: v61.72,22.23 64.14,22.23 64.14,31.24 70.25,31.24 U7.P$18
RESET
  Top 0.254: 47.88,33.66 47.88,35.67 39.73,35.67 J1.5 | 47.88,33.66 47.88,29.59 50.19,29.59 U2.4 | C1.2 47.86,33.64 47.88,33.66
  Bottom 0.254: S1.P$2 38.11,28.19 R4.1 37.95,30.71 J1.5
RXD0  (via drill 0.6)
  Top 0.254: v53.72,26.04 52.32,26.04 51.94,25.65 50.29,25.65 U2.9 | JP7.3 v75.56,20.95
  Bottom 0.254: v53.72,26.04 67.69,12.06 71.75,12.06 73.03,13.34 73.03,20.95 v75.56,20.95
RXD1  (via drill 0.6)
  Top 0.254: U2.11 50.19,20.34 49.53,19.68 39.37,19.68 v39.37,27.3
  Bottom 0.254: U7.P$60 41.14,27.3 v39.37,27.3
SCK
  Top 0.254: J1.3 37.95,36.32 48.39,36.32 48.39,30.36 U2.3 51.31,30.36 51.31,34.92 55.12,38.73 57.15,38.73 59.05,40.64 JP6.3
SIM_CLK
  Bottom 0.254: U7.P$14 65.75,34.42 55.88,34.42 50.04,40.26 R2.1
SIM_CLKR  (via drill 0.6)
  Top 0.254: v41.66,34.29 41.4,34.04 41.4,32.64 38.86,30.1 33.91,30.1 32.26,28.45 27.69,28.45 21.46,22.23 v4.45,22.23
  Bottom 0.254: R2.2 44.3,39.37 41.66,39.37 v41.66,34.29 | v4.45,22.23 v4.44,22.22 X3.C3
SIM_DATA
  Bottom 0.254: U7.P$13 64.45,35.05 56.13,35.05 50.8,40.39 50.8,40.51 49.15,42.16 43.84,42.16 R3.1
SIM_DATAR  (via drill 0.6)
  Top 0.254: v40.26,33.91 39.88,33.53 39.88,32 39.24,31.37 29.46,31.37 v28.32,30.23
  Bottom 0.254: R3.2 40.39,41.17 v40.26,33.91 | v28.32,30.23 26.92,28.83 26.92,22.61 27.3,22.23 X3.C7
SIM_RST
  Bottom 0.254: U7.P$15 67.06,39.37 53.47,39.37 52.32,40.51 52.32,42.16 51.18,43.31 38,43.31 R6.1
SIM_RSTR  (via drill 0.6)
  Top 0.254: v32.77,40.26 32.13,39.62 32.13,32.51 27.3,32.51 v25.91,31.11
  Bottom 0.254: R6.2 33.76,41.25 v32.77,40.26 | v25.91,31.11 25.15,31.11 22.61,28.57 8.26,28.57 4.45,24.77 X3.C2
SIM_VDD  (via drill 0.6)
  Top 0.254: v33.02,38.73 33.02,31.88 28.45,31.88 26.67,30.1 25.15,30.1 18.54,23.5 1.52,23.5 1.14,23.88 v1.14,26.04
  Bottom 0.254: U7.P$12 63.15,35.69 56.26,35.69 51.44,40.51 51.44,41.91 50.67,42.67 38.86,42.67 38.1,41.91 38.1,40.64 34.92,40.64 v33.02,38.73 | 3.17,27.3 X3.C1 2.41,27.3 v1.14,26.04
SPK1N
  Bottom 0.254: U7.P$21 71.23,27.42 79.38,35.56 SPEAKER.P$1 86.36,41.27 SPK.2
SPK1P
  Bottom 0.254: SPK.1 89.53,36.2 SPEAKER.P$2 80.01,33.02 73.11,26.12 U7.P$22
STATUS
  Bottom 0.254: U7.P$54 40.07,19.62 38.1,21.59 38.1,23.01 LED2.A
TXD0  (via drill 0.6)
  Top 0.254: v52.7,24.77 U2.10 | JP7.2 v74.93,18.41
  Bottom 0.254: v52.7,24.77 66.04,11.43 72.39,11.43 74.93,13.97 v74.93,18.41
TXD1  (via drill 0.6)
  Top 0.254: U2.12 51.99,19.22 51.56,18.8 38.35,18.8 38.35,27.94 39.24,28.83 v39.37,28.83
  Bottom 0.254: v39.37,28.83 39.48,28.72 U7.P$61
VCC  (via drill 0.6)
  Top 0.254: C12.1 55.99,19.3 U2.17 55.99,27.16 56.52,27.16 | 56.52,28.76 U2.5 47.37,28.76 47.37,32.38 44.7,32.38 44.7,35.18 40.01,35.18 39.37,34.54 39.37,33.02 38.61,32.26 v36.45,32.26 33.91,32.26 v33.91,35.31 | 56.52,28.76 56.79,28.76 U2.38 | 56.52,27.16 U2.27 81.92,27.16 | 56.52,27.16 56.52,28.76 | JP8.1 81.92,27.16 | JP9.1 81.92,27.94 | 81.92,27.94 81.92,27.16 | v88.9,29.21 88.9,27.94 81.92,27.94
  Top 1.016: JP3.2 10.16,37.23 10.16,36.59
  Top 1.93: 10.16,34.04 4.45,34.05 C11.+ | 10.16,36.59 10.16,34.04 | 10.16,34.04 10.16,31.5 23.5,31.5 v26.04,33.91
  Bottom 0.254: 31.75,30.48 31.98,30.71 | v36.45,32.26 36.45,32.15 R4.2 | v33.91,35.31 33.91,37.47 J1.2 | LED3.A 86.36,29.21 v88.9,29.21
  Bottom 0.406: U7.P$52 U7.P$51 U7.P$50
  Bottom 0.61: 31.98,30.71 R4.2
  Bottom 1.778: C13.1 39.97,15.72
  Bottom 1.93: C16.+ 31.75,20.19 31.75,30.48 28.57,33.66 28.57,34.92
  Bottom 2.54: U7.P$51 39.97,15.72 C16.+
  other vias: 24.51,34.67 26.04,35.31 30.48,34.92
  pour Bottom (isolate 0.254, no thermals): 23.5,36.07 31.75,36.07 31.75,33.02 23.5,33.02
  pour Top (isolate 0.254): 23.5,36.07 31.75,36.07 31.75,33.02 23.5,33.02
VRTC  (via drill 0.6)
  Top 0.254: C2.+ 68.58,34.85 v68.58,34.92
  Bottom 0.254: v68.58,34.92 68.35,34.92 U7.P$16
VUSB  (via drill 0.6)
  Bottom 0.254: LED1.A 19.02,43.81 15.24,43.81 15.24,35.3 C3.1
  Bottom 0.406: J2.VBUS 8.26,36.63 8.26,36.2
  Bottom 1.016: C3.1 12.96,35.3 12.06,36.2 8.26,36.2 7.62,36.2
  other vias: 19.94,35.31 19.94,33.91 21.34,33.91 18.54,33.91 18.54,35.31
  pour Bottom (isolate 0.254, no thermals): 22.1,36.07 15.88,36.07 15.88,33.15 22.1,33.15
  pour Top (isolate 0.254, no thermals): 15.88,33.15 22.1,33.15 22.1,36.07 15.88,36.07

### Text on the board
tNames: 5 | 6 | 7 | 31 | 30 | 29 | 28 | 27 | 26 | 25 | 24 | VCC | GND | SPK | Cellphone Module / David A. Mellis / Nov. 26, 2013 | 12 | 13 | 14 | 15 | 16 | 17 | 18 | 20 | 21 | 22 | 23 | VCC | GND | MIC
bNames: 5 | 6 | 7 | 31 | 30 | 29 | 28 | 27 | 26 | 25 | 24 | VCC | GND | SPK | 12 | 13 | 14 | 15 | 16 | 17 | 18 | 20 | 21 | 22 | 23 | VCC | GND | MIC
tValues: B | G